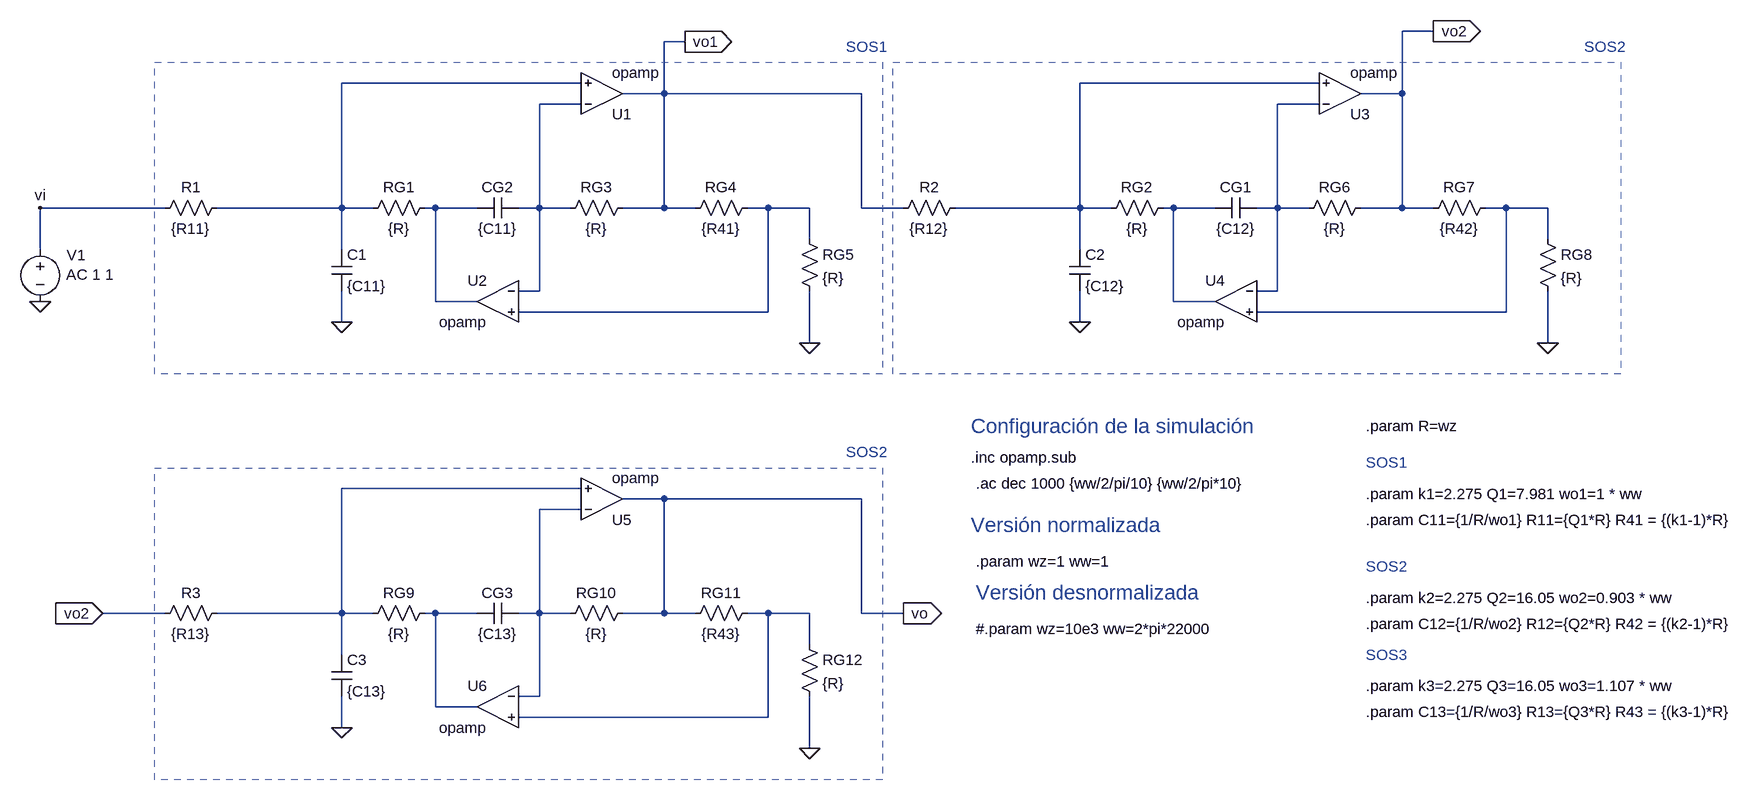
[diagram p0: schematic TS4.asc]
TS4.asc, the LTspice schematic file:
Version 4
SHEET 1 2616 1448
WIRE 1792 -96 1744 -96
WIRE 640 -80 608 -80
WIRE 480 -16 112 -16
WIRE 1616 -16 1248 -16
WIRE 608 0 608 -80
WIRE 608 0 544 0
WIRE 912 0 608 0
WIRE 1744 0 1744 -96
WIRE 1744 0 1680 0
WIRE 480 16 416 16
WIRE 1616 16 1552 16
WIRE -160 176 -352 176
WIRE 112 176 112 -16
WIRE 112 176 -80 176
WIRE 160 176 112 176
WIRE 256 176 240 176
WIRE 320 176 256 176
WIRE 416 176 416 16
WIRE 416 176 384 176
WIRE 464 176 416 176
WIRE 608 176 608 0
WIRE 608 176 544 176
WIRE 656 176 608 176
WIRE 768 176 736 176
WIRE 832 176 768 176
WIRE 912 176 912 0
WIRE 976 176 912 176
WIRE 1248 176 1248 -16
WIRE 1248 176 1056 176
WIRE 1296 176 1248 176
WIRE 1392 176 1376 176
WIRE 1456 176 1392 176
WIRE 1552 176 1552 16
WIRE 1552 176 1520 176
WIRE 1600 176 1552 176
WIRE 1744 176 1744 0
WIRE 1744 176 1680 176
WIRE 1792 176 1744 176
WIRE 1904 176 1872 176
WIRE 1968 176 1904 176
WIRE 832 224 832 176
WIRE 1968 224 1968 176
WIRE -352 240 -352 176
WIRE 112 240 112 176
WIRE 1248 240 1248 176
WIRE 416 304 416 176
WIRE 416 304 384 304
WIRE 1552 304 1552 176
WIRE 1552 304 1520 304
WIRE 256 320 256 176
WIRE 320 320 256 320
WIRE 1392 320 1392 176
WIRE 1456 320 1392 320
WIRE 768 336 768 176
WIRE 768 336 384 336
WIRE 1904 336 1904 176
WIRE 1904 336 1520 336
WIRE 112 352 112 304
WIRE 1248 352 1248 304
WIRE 832 384 832 304
WIRE 1968 384 1968 304
WIRE 480 608 112 608
WIRE 608 624 544 624
WIRE 912 624 608 624
WIRE 480 640 416 640
WIRE -160 800 -256 800
WIRE 112 800 112 608
WIRE 112 800 -80 800
WIRE 160 800 112 800
WIRE 256 800 240 800
WIRE 320 800 256 800
WIRE 416 800 416 640
WIRE 416 800 384 800
WIRE 464 800 416 800
WIRE 608 800 608 624
WIRE 608 800 544 800
WIRE 656 800 608 800
WIRE 768 800 736 800
WIRE 832 800 768 800
WIRE 912 800 912 624
WIRE 976 800 912 800
WIRE 832 848 832 800
WIRE 112 864 112 800
WIRE 416 928 416 800
WIRE 416 928 384 928
WIRE 256 944 256 800
WIRE 320 944 256 944
WIRE 768 960 768 800
WIRE 768 960 384 960
WIRE 112 976 112 928
WIRE 832 1008 832 928
FLAG 832 384 0
FLAG -352 320 0
FLAG -352 176 vi
FLAG 976 800 vo
IOPIN 976 800 Out
FLAG 640 -80 vo1
IOPIN 640 -80 Out
FLAG 1792 -96 vo2
IOPIN 1792 -96 Out
FLAG 112 352 0
FLAG 1968 384 0
FLAG 1248 352 0
FLAG -256 800 vo2
IOPIN -256 800 In
FLAG 832 1008 0
FLAG 112 976 0
SYMBOL res -64 160 R90
WINDOW 0 0 56 VBottom 2
WINDOW 3 32 56 VTop 2
SYMATTR InstName R1
SYMATTR Value {R11}
SYMBOL res 144 192 R270
WINDOW 0 32 56 VTop 2
WINDOW 3 0 56 VBottom 2
SYMATTR InstName RG1
SYMATTR Value {R}
SYMBOL res 448 192 R270
WINDOW 0 32 56 VTop 2
WINDOW 3 0 56 VBottom 2
SYMATTR InstName RG3
SYMATTR Value {R}
SYMBOL res 640 192 R270
WINDOW 0 32 56 VTop 2
WINDOW 3 0 56 VBottom 2
SYMATTR InstName RG4
SYMATTR Value {R41}
SYMBOL res 816 208 R0
SYMATTR InstName RG5
SYMATTR Value {R}
SYMBOL cap 96 240 R0
SYMATTR InstName C1
SYMATTR Value {C11}
SYMBOL cap 320 192 R270
WINDOW 0 32 32 VTop 2
WINDOW 3 0 32 VBottom 2
SYMATTR InstName CG2
SYMATTR Value {C11}
SYMBOL OpAmps\\opamp 512 64 M180
SYMATTR InstName U1
SYMBOL OpAmps\\opamp 352 256 M0
SYMATTR InstName U2
SYMBOL voltage -352 224 R0
WINDOW 123 40 55 Left 2
WINDOW 39 0 0 Left 0
WINDOW 0 41 25 Left 2
SYMATTR Value2 AC 1 1
SYMATTR InstName V1
SYMATTR Value ""
SYMBOL res 1072 160 R90
WINDOW 0 0 56 VBottom 2
WINDOW 3 32 56 VTop 2
SYMATTR InstName R2
SYMATTR Value {R12}
SYMBOL res 1280 192 R270
WINDOW 0 32 56 VTop 2
WINDOW 3 0 56 VBottom 2
SYMATTR InstName RG2
SYMATTR Value {R}
SYMBOL res 1584 192 R270
WINDOW 0 32 56 VTop 2
WINDOW 3 0 56 VBottom 2
SYMATTR InstName RG6
SYMATTR Value {R}
SYMBOL res 1776 192 R270
WINDOW 0 32 56 VTop 2
WINDOW 3 0 56 VBottom 2
SYMATTR InstName RG7
SYMATTR Value {R42}
SYMBOL res 1952 208 R0
SYMATTR InstName RG8
SYMATTR Value {R}
SYMBOL cap 1232 240 R0
SYMATTR InstName C2
SYMATTR Value {C12}
SYMBOL cap 1456 192 R270
WINDOW 0 32 32 VTop 2
WINDOW 3 0 32 VBottom 2
SYMATTR InstName CG1
SYMATTR Value {C12}
SYMBOL OpAmps\\opamp 1648 64 M180
SYMATTR InstName U3
SYMBOL OpAmps\\opamp 1488 256 M0
SYMATTR InstName U4
SYMBOL res -64 784 R90
WINDOW 0 0 56 VBottom 2
WINDOW 3 32 56 VTop 2
SYMATTR InstName R3
SYMATTR Value {R13}
SYMBOL res 144 816 R270
WINDOW 0 32 56 VTop 2
WINDOW 3 0 56 VBottom 2
SYMATTR InstName RG9
SYMATTR Value {R}
SYMBOL res 448 816 R270
WINDOW 0 32 56 VTop 2
WINDOW 3 0 56 VBottom 2
SYMATTR InstName RG10
SYMATTR Value {R}
SYMBOL res 640 816 R270
WINDOW 0 32 56 VTop 2
WINDOW 3 0 56 VBottom 2
SYMATTR InstName RG11
SYMATTR Value {R43}
SYMBOL res 816 832 R0
SYMATTR InstName RG12
SYMATTR Value {R}
SYMBOL cap 96 864 R0
SYMATTR InstName C3
SYMATTR Value {C13}
SYMBOL cap 320 816 R270
WINDOW 0 32 32 VTop 2
WINDOW 3 0 32 VBottom 2
SYMATTR InstName CG3
SYMATTR Value {C13}
SYMBOL OpAmps\\opamp 512 688 M180
SYMATTR InstName U5
SYMBOL OpAmps\\opamp 352 880 M0
SYMATTR InstName U6
TEXT 1080 560 Left 2 !.inc opamp.sub
TEXT 1088 600 Left 2 !.ac dec 1000 {ww/2/pi/10} {ww/2/pi*10}
TEXT 1688 616 Left 2 !.param k1=2.275 Q1=7.981 wo1=1 * ww
TEXT 1088 824 Left 2 !#.param wz=10e3 ww=2*pi*22000
TEXT 1080 664 Left 3 ;Versión normalizada
TEXT 1088 768 Left 3 ;Versión desnormalizada
TEXT 1688 656 Left 2 !.param C11={1/R/wo1} R11={Q1*R} R41 = {(k1-1)*R}
TEXT 1088 720 Left 2 !.param wz=1 ww=1
TEXT 1688 568 Left 2 ;SOS1
TEXT 1688 728 Left 2 ;SOS2
TEXT 1688 512 Left 2 !.param R=wz
TEXT 1080 512 Left 3 ;Configuración de la simulación
TEXT 888 -72 Left 2 ;SOS1
TEXT 2024 -72 Left 2 ;SOS2
TEXT 888 552 Left 2 ;SOS2
TEXT 1688 912 Left 2 !.param k3=2.275 Q3=16.05 wo3=1.107 * ww
TEXT 1688 952 Left 2 !.param C13={1/R/wo3} R13={Q3*R} R43 = {(k3-1)*R}
TEXT 1688 864 Left 2 ;SOS3
TEXT 1688 776 Left 2 !.param k2=2.275 Q2=16.05 wo2=0.903 * ww
TEXT 1688 816 Left 2 !.param C12={1/R/wo2} R12={Q2*R} R42 = {(k2-1)*R}
RECTANGLE Normal 944 432 -176 -48 2
RECTANGLE Normal 2080 432 960 -48 2
RECTANGLE Normal 944 1056 -176 576 2

The netlist it stands for:
* TS4.asc
R1 N001 vi {R11}
RG1 N001 N005 {R}
RG3 N003 vo1 {R}
RG4 vo1 N006 {R41}
RG5 N006 0 {R}
C1 N001 0 {C11}
CG2 N005 N003 {C11}
XU1 N003 N001 vo1 opamp Aol=100K GBW=10Meg  ; pins invin noninvin out
XU2 N003 N006 N005 opamp Aol=100K GBW=10Meg  ; pins invin noninvin out
V1 vi 0 AC 1 1
R2 N002 vo1 {R12}
RG2 N002 N007 {R}
RG6 N004 vo2 {R}
RG7 vo2 N008 {R42}
RG8 N008 0 {R}
C2 N002 0 {C12}
CG1 N007 N004 {C12}
XU3 N004 N002 vo2 opamp Aol=100K GBW=10Meg  ; pins invin noninvin out
XU4 N004 N008 N007 opamp Aol=100K GBW=10Meg  ; pins invin noninvin out
R3 N009 vo2 {R13}
RG9 N009 N011 {R}
RG10 N010 vo {R}
RG11 vo N012 {R43}
RG12 N012 0 {R}
C3 N009 0 {C13}
CG3 N011 N010 {C13}
XU5 N010 N009 vo opamp Aol=100K GBW=10Meg  ; pins invin noninvin out
XU6 N010 N012 N011 opamp Aol=100K GBW=10Meg  ; pins invin noninvin out
.inc opamp.sub
.ac dec 1000 {ww/2/pi/10} {ww/2/pi*10}
.param k1=2.275 Q1=7.981 wo1=1 * ww
#.param wz=10e3 ww=2*pi*22000
* Versión normalizada
* Versión desnormalizada
.param C11={1/R/wo1} R11={Q1*R} R41 = {(k1-1)*R}
.param wz=1 ww=1
* SOS1
* SOS2
.param R=wz
* Configuración de la simulación
* SOS1
* SOS2
* SOS2
.param k3=2.275 Q3=16.05 wo3=1.107 * ww
.param C13={1/R/wo3} R13={Q3*R} R43 = {(k3-1)*R}
* SOS3
.param k2=2.275 Q2=16.05 wo2=0.903 * ww
.param C12={1/R/wo2} R12={Q2*R} R42 = {(k2-1)*R}
.backanno
.end